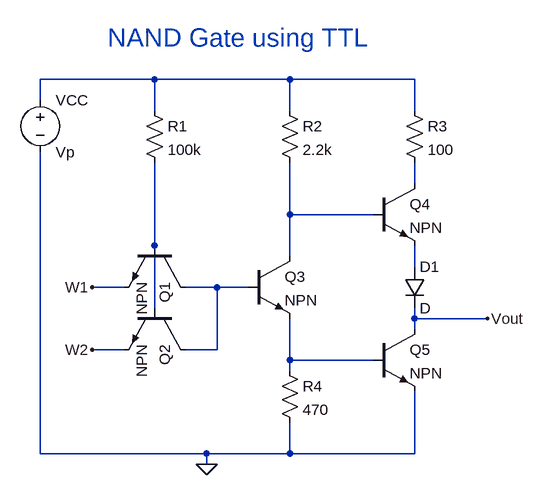
[diagram p0: schematic Draft41.asc]
Draft41.asc, the LTspice schematic file:
Version 4
SHEET 1 880 680
WIRE 32 64 -144 64
WIRE 240 64 32 64
WIRE 432 64 240 64
WIRE -144 96 -144 64
WIRE 32 112 32 64
WIRE 240 112 240 64
WIRE 432 112 432 64
WIRE 432 224 432 192
WIRE 240 272 240 192
WIRE 368 272 240 272
WIRE 32 320 32 192
WIRE 240 336 240 272
WIRE 432 352 432 320
WIRE -16 384 -64 384
WIRE 128 384 80 384
WIRE 176 384 128 384
WIRE 32 416 32 320
WIRE 432 432 432 416
WIRE 544 432 432 432
WIRE 432 448 432 432
WIRE -16 480 -64 480
WIRE 128 480 128 384
WIRE 128 480 80 480
WIRE 240 496 240 432
WIRE 368 496 240 496
WIRE 240 512 240 496
WIRE -144 640 -144 176
WIRE 112 640 -144 640
WIRE 240 640 240 592
WIRE 240 640 112 640
WIRE 432 640 432 544
WIRE 432 640 240 640
WIRE 112 656 112 640
FLAG 544 432 Vout
FLAG -64 384 W1
FLAG -64 480 W2
FLAG 112 656 0
SYMBOL res 16 96 R0
SYMATTR InstName R1
SYMATTR Value 100k
SYMBOL res 224 96 R0
SYMATTR InstName R2
SYMATTR Value 2.2k
SYMBOL res 416 96 R0
SYMATTR InstName R3
SYMATTR Value 100
SYMBOL npn 80 320 R90
SYMATTR InstName Q1
SYMBOL npn 80 416 R90
SYMATTR InstName Q2
SYMBOL npn 176 336 R0
SYMATTR InstName Q3
SYMBOL npn 368 224 R0
SYMATTR InstName Q4
SYMBOL diode 416 352 R0
SYMATTR InstName D1
SYMBOL npn 368 448 R0
SYMATTR InstName Q5
SYMBOL res 224 496 R0
SYMATTR InstName R4
SYMATTR Value 470
SYMBOL voltage -144 80 R0
SYMATTR InstName VCC
SYMATTR Value Vp
TEXT -40 0 Left 4 ;NAND Gate using TTL

The netlist it stands for:
* Draft41.asc
R1 N001 N004 100k
R2 N001 N003 2.2k
R3 N001 N002 100
Q1 N006 N004 W1 0 NPN
Q2 N006 N004 W2 0 NPN
Q3 N003 N006 N007 0 NPN
Q4 N002 N003 N005 0 NPN
D1 N005 Vout D
Q5 Vout N007 0 0 NPN
R4 N007 0 470
VCC N001 0 Vp
.model D D
.lib standard.dio
.model NPN NPN
.model PNP PNP
.lib standard.bjt
* NAND Gate using TTL
.backanno
.end